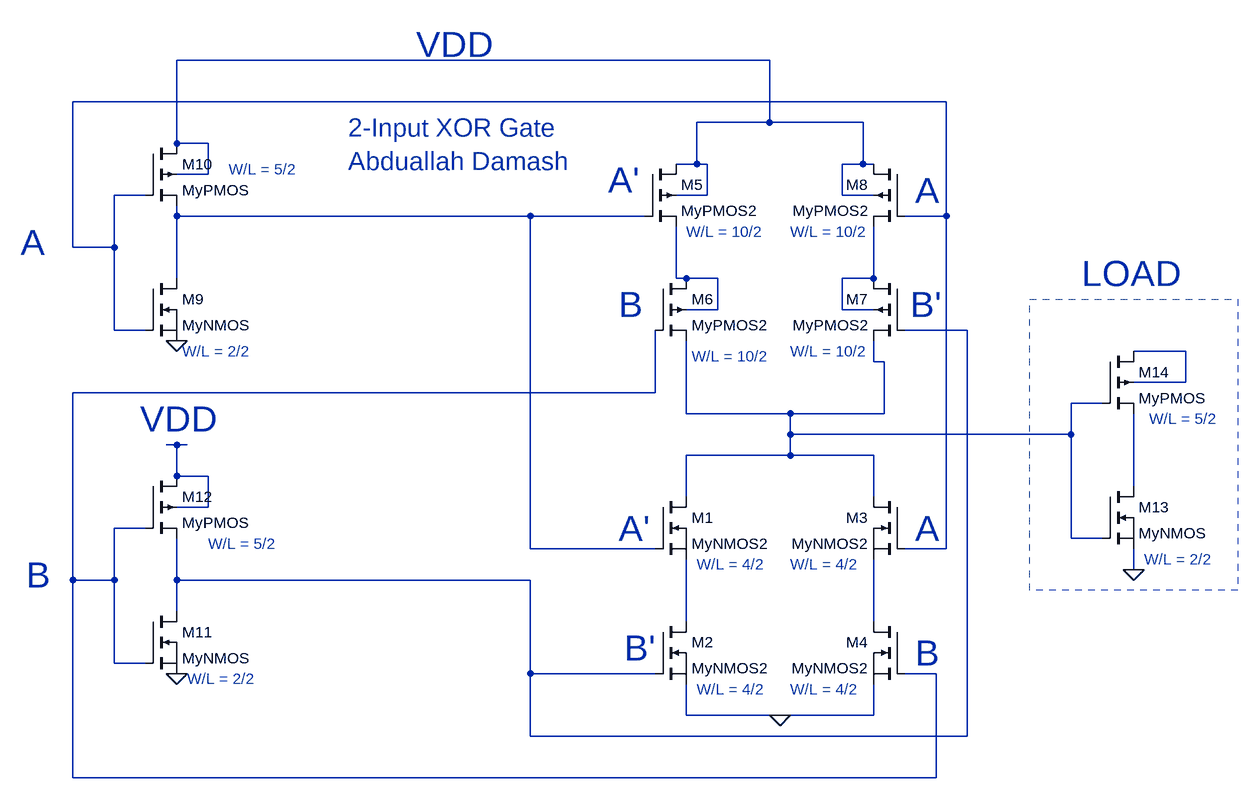
[diagram p0: schematic XOR Design For Report.asc]
XOR Design For Report.asc, the LTspice schematic file:
Version 4
SHEET 1 1596 680
WIRE 176 -640 -736 -640
WIRE 448 -576 -896 -576
WIRE 176 -544 176 -640
WIRE 176 -544 64 -544
WIRE 320 -544 176 -544
WIRE -736 -512 -736 -640
WIRE -688 -512 -736 -512
WIRE 64 -480 64 -544
WIRE 64 -480 32 -480
WIRE 80 -480 64 -480
WIRE 320 -480 320 -544
WIRE 320 -480 288 -480
WIRE 336 -480 320 -480
WIRE -688 -464 -688 -512
WIRE -688 -464 -736 -464
WIRE -784 -432 -832 -432
WIRE 80 -432 80 -480
WIRE 80 -432 32 -432
WIRE 288 -432 288 -480
WIRE 336 -432 288 -432
WIRE -736 -400 -736 -416
WIRE -192 -400 -736 -400
WIRE -16 -400 -192 -400
WIRE 448 -400 448 -576
WIRE 448 -400 384 -400
WIRE -896 -352 -896 -576
WIRE -832 -352 -832 -432
WIRE -832 -352 -896 -352
WIRE -736 -304 -736 -400
WIRE 32 -304 32 -384
WIRE 48 -304 32 -304
WIRE 96 -304 48 -304
WIRE 336 -304 336 -384
WIRE 336 -304 288 -304
WIRE 96 -256 96 -304
WIRE 96 -256 48 -256
WIRE 288 -256 288 -304
WIRE 336 -256 288 -256
WIRE -832 -224 -832 -352
WIRE -784 -224 -832 -224
WIRE 480 -224 384 -224
WIRE 816 -192 736 -192
WIRE 336 -176 336 -208
WIRE 352 -176 336 -176
WIRE 816 -144 816 -192
WIRE 816 -144 736 -144
WIRE 0 -128 0 -224
WIRE 0 -128 -896 -128
WIRE 688 -112 640 -112
WIRE 48 -96 48 -208
WIRE 208 -96 48 -96
WIRE 352 -96 352 -176
WIRE 352 -96 208 -96
WIRE 208 -64 208 -96
WIRE 640 -64 640 -112
WIRE 640 -64 208 -64
WIRE -736 -48 -752 -48
WIRE -720 -48 -736 -48
WIRE 208 -32 208 -64
WIRE 208 -32 48 -32
WIRE 336 -32 208 -32
WIRE -736 0 -736 -48
WIRE -688 0 -736 0
WIRE 736 16 736 -96
WIRE 48 32 48 -32
WIRE 336 32 336 -32
WIRE -688 48 -688 0
WIRE -688 48 -736 48
WIRE -784 80 -832 80
WIRE 640 96 640 -64
WIRE 688 96 640 96
WIRE -192 112 -192 -400
WIRE 0 112 -192 112
WIRE 448 112 448 -400
WIRE 448 112 384 112
WIRE 736 144 736 112
WIRE -896 160 -896 -128
WIRE -832 160 -832 80
WIRE -832 160 -896 160
WIRE -736 160 -736 96
WIRE -192 160 -736 160
WIRE -736 208 -736 160
WIRE 48 224 48 128
WIRE 336 224 336 128
WIRE -832 288 -832 160
WIRE -784 288 -832 288
WIRE -192 304 -192 160
WIRE 0 304 -192 304
WIRE 432 304 384 304
WIRE 48 368 48 320
WIRE 192 368 48 368
WIRE 336 368 336 320
WIRE 336 368 192 368
WIRE -192 400 -192 304
WIRE 480 400 480 -224
WIRE 480 400 -192 400
WIRE -896 464 -896 160
WIRE 432 464 432 304
WIRE 432 464 -896 464
FLAG 192 368 0
FLAG -736 -208 0
FLAG -736 304 0
FLAG 736 144 0
SYMBOL nmos 0 32 R0
SYMATTR InstName M1
SYMATTR Value MyNMOS2
SYMBOL nmos 0 224 R0
SYMATTR InstName M2
SYMATTR Value MyNMOS2
SYMBOL nmos 384 32 M0
SYMATTR InstName M3
SYMATTR Value MyNMOS2
SYMBOL nmos 384 224 M0
SYMATTR InstName M4
SYMATTR Value MyNMOS2
SYMBOL pmos4 -16 -480 R0
SYMATTR InstName M5
SYMATTR Value MyPMOS2
SYMBOL pmos4 0 -304 R0
SYMATTR InstName M6
SYMATTR Value MyPMOS2
SYMBOL pmos4 384 -304 M0
SYMATTR InstName M7
SYMATTR Value MyPMOS2
SYMBOL pmos4 384 -480 M0
SYMATTR InstName M8
SYMATTR Value MyPMOS2
SYMBOL nmos -784 -304 R0
SYMATTR InstName M9
SYMATTR Value MyNMOS
SYMBOL pmos4 -784 -512 R0
SYMATTR InstName M10
SYMATTR Value MyPMOS
SYMBOL nmos -784 208 R0
SYMATTR InstName M11
SYMATTR Value MyNMOS
SYMBOL pmos4 -784 0 R0
SYMATTR InstName M12
SYMATTR Value MyPMOS
SYMBOL nmos 688 16 R0
SYMATTR InstName M13
SYMATTR Value MyNMOS
SYMBOL pmos4 688 -192 R0
SYMATTR InstName M14
SYMATTR Value MyPMOS
TEXT -968 152 Left 5 ;B
TEXT -976 -360 Left 5 ;A
TEXT -48 264 Left 5 ;B'
TEXT 400 272 Left 5 ;B
TEXT -56 80 Left 5 ;A'
TEXT 400 80 Left 5 ;A
TEXT -56 -264 Left 5 ;B
TEXT 392 -264 Left 5 ;B'
TEXT -72 -456 Left 5 ;A'
TEXT 400 -440 Left 5 ;A
TEXT -792 -88 Left 5 ;VDD
TEXT -368 -664 Left 5 ;VDD
TEXT 656 -312 Left 5 ;LOAD
TEXT -656 -472 Left 2 ;W/L = 5/2
TEXT 208 136 Left 2 ;W/L = 4/2
TEXT 64 136 Left 2 ;W/L = 4/2
TEXT 64 328 Left 2 ;W/L = 4/2
TEXT 760 -88 Left 2 ;W/L = 5/2
TEXT 752 128 Left 2 ;W/L = 2/2
TEXT 208 328 Left 2 ;W/L = 4/2
TEXT -688 104 Left 2 ;W/L = 5/2
TEXT -720 312 Left 2 ;W/L = 2/2
TEXT -728 -192 Left 2 ;W/L = 2/2
TEXT 208 -192 Left 2 ;W/L = 10/2
TEXT 56 -184 Left 2 ;W/L = 10/2
TEXT 48 -376 Left 2 ;W/L = 10/2
TEXT 208 -376 Left 2 ;W/L = 10/2
TEXT -472 -536 Left 4 ;2-Input XOR Gate\nAbduallah Damash
RECTANGLE Normal 896 176 576 -272 2

The netlist it stands for:
* XOR Design For Report.asc
M1 N008 N003 N012 N012 MyNMOS2
M2 N012 N006 0 0 MyNMOS2
M3 N008 N002 N013 N013 MyNMOS2
M4 N013 N009 0 0 MyNMOS2
M5 N001 N003 N004 N001 MyPMOS2
M6 N004 N009 N008 N004 MyPMOS2
M7 N005 N006 N008 N005 MyPMOS2
M8 N001 N002 N005 N001 MyPMOS2
M9 N003 N002 0 0 MyNMOS
M10 N001 N002 N003 N001 MyPMOS
M11 N006 N009 0 0 MyNMOS
M12 N010 N009 N006 N010 MyPMOS
M13 N011 N008 0 0 MyNMOS
M14 N007 N008 N011 N007 MyPMOS
.model NMOS NMOS
.model PMOS PMOS
.lib standard.mos
* B
* A
* B'
* B
* A'
* A
* B
* B'
* A'
* A
* VDD
* VDD
* LOAD
* W/L = 5/2
* W/L = 4/2
* W/L = 4/2
* W/L = 4/2
* W/L = 5/2
* W/L = 2/2
* W/L = 4/2
* W/L = 5/2
* W/L = 2/2
* W/L = 2/2
* W/L = 10/2
* W/L = 10/2
* W/L = 10/2
* W/L = 10/2
* 2-Input XOR Gate
* Abduallah Damash
.backanno
.end